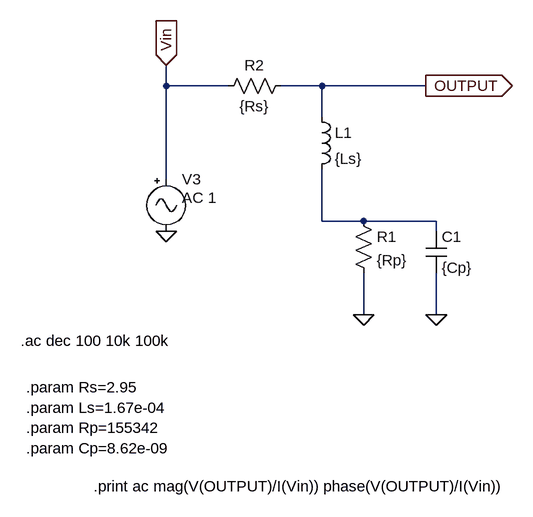
[diagram p0: schematic hydrophoneSimAC.asc]
hydrophoneSimAC.asc, the LTspice schematic file:
Version 4.1
SHEET 1 2364 732
WIRE 1776 32 1776 0
WIRE 1872 32 1776 32
WIRE 2016 32 1952 32
WIRE 2176 32 2016 32
WIRE 2016 80 2016 32
WIRE 1776 176 1776 32
WIRE 2016 240 2016 160
WIRE 2080 240 2016 240
WIRE 2192 240 2080 240
WIRE 2192 256 2192 240
WIRE 2080 384 2080 320
WIRE 2192 384 2192 320
FLAG 2176 32 OUTPUT
IOPIN 2176 32 Out
FLAG 1776 256 0
FLAG 2080 384 0
FLAG 2192 384 0
FLAG 1776 0 Vin
IOPIN 1776 0 In
SYMBOL Misc\\signal 1776 160 R0
WINDOW 123 24 44 Left 2
WINDOW 39 0 0 Left 0
SYMATTR InstName V3
SYMATTR Value ""
SYMATTR Value2 AC 1
SYMBOL ind 2000 64 R0
SYMATTR InstName L1
SYMATTR Value {Ls}
SYMBOL res 2064 224 R0
SYMATTR InstName R1
SYMATTR Value {Rp}
SYMBOL cap 2176 256 R0
SYMATTR InstName C1
SYMATTR Value {Cp}
SYMBOL res 1968 16 R90
WINDOW 0 0 56 VBottom 2
WINDOW 3 32 56 VTop 2
SYMATTR InstName R2
SYMATTR Value {Rs}
TEXT 1552 424 Left 2 !.ac dec 100 10k 100k
TEXT 1560 496 Left 2 !.param Rs=2.95\n.param Ls=1.67e-04\n.param Rp=155342\n.param Cp=8.62e-09
TEXT 1664 648 Left 2 !.print ac mag(V(OUTPUT)/I(Vin)) phase(V(OUTPUT)/I(Vin))

The netlist it stands for:
* hydrophoneSimAC.asc
V3 Vin 0 AC 1
L1 OUTPUT N001 {Ls}
R1 N001 0 {Rp}
C1 N001 0 {Cp}
R2 OUTPUT Vin {Rs}
.ac dec 100 10k 100k
.param Rs=2.95
.param Ls=1.67e-04
.param Rp=155342
.param Cp=8.62e-09
.print ac mag(V(OUTPUT)/I(Vin)) phase(V(OUTPUT)/I(Vin))
.backanno
.end

* Results of the author's LTspice run, read from the files saved beside the schematic
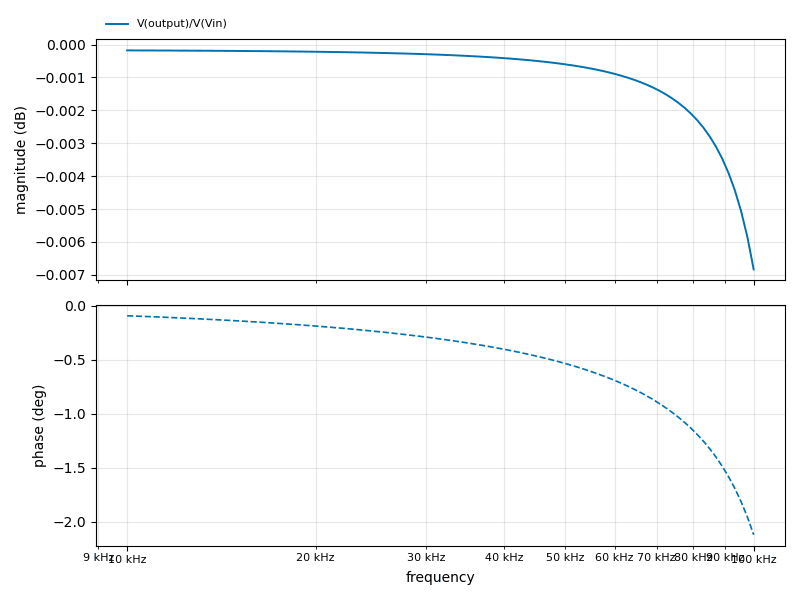
[diagram p1: AC Analysis of hydrophoneSimAC.asc, plotted from the saved traces]
* AC Analysis, 1 run:
*   V(output)/V(Vin): -0.00 dB at 10 kHz, -0.01 dB at 100 kHz, peak -0.00 dB at 10 kHz